# EAGLE schematic shield_ct_sensor (EAGLE 7.2.0)
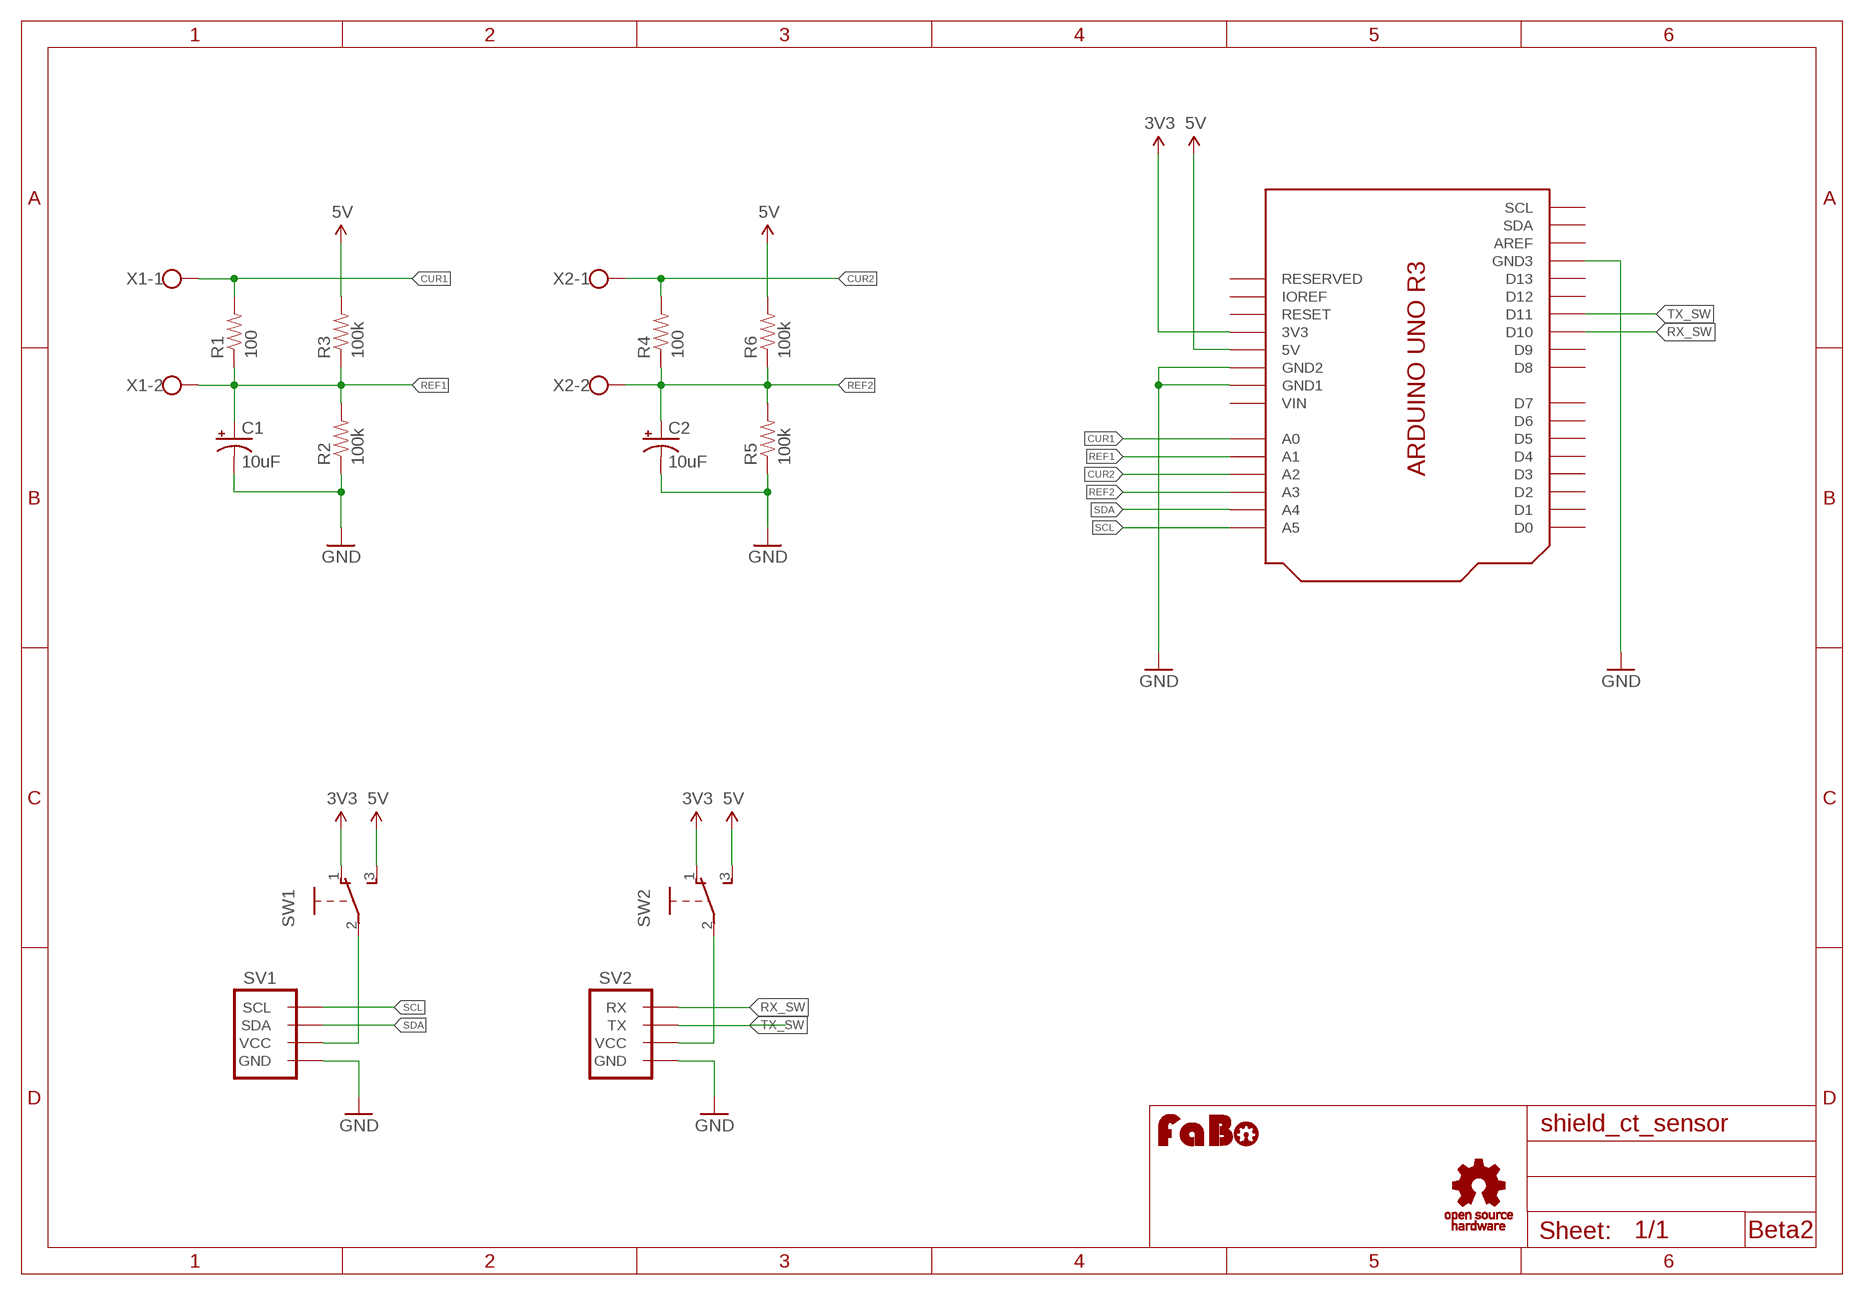
[diagram p0: schematic, sheet 1]

## Parts
C1  10uF  CAP_POL-AXL-5MM  [CAP-POL-AXL-5MM]
C2  10uF  CAP_POL-AXL-5MM  [CAP-POL-AXL-5MM]
R1  100  RES-PTH-REGULAR  [RES-AXL-REGULAR]
R2  100k  RES-PTH-REGULAR  [RES-AXL-REGULAR]
R3  100k  RES-PTH-REGULAR  [RES-AXL-REGULAR]
R4  100  RES-PTH-REGULAR  [RES-AXL-REGULAR]
R5  100k  RES-PTH-REGULAR  [RES-AXL-REGULAR]
R6  100k  RES-PTH-REGULAR  [RES-AXL-REGULAR]
SV1  BRICK_I2C_CONNECTOR  [BRICK_I2C_CONNECTOR]
SV2  BRICK_SERIAL_CONNECTOR  [BRICK_SERIAL_CONNECTOR]
SW1  SWITCH-SLIDE-EG1218  [EG1218]
SW2  SWITCH-SLIDE-EG1218  [EG1218]
U1  ARDUINO_UNO_R3_SHIELD  [ARDUINO_UNO_R3]
U$2  LOGO_FABO-M  [LOGO_FABO_M]
U$3  LOGO_OSHW_T-M  [LOGO_OSHW_T_M]
X1  W237-102  [W237-102]
X2  W237-102  [W237-102]

## Nets
3V3: SW1.1 SW2.1 U1.3V3
5V: R3.P$2 R6.P$2 SW1.3 SW2.3 U1.5V
CUR1: R1.P$2 U1.A0 X1.1
CUR2: R4.P$2 U1.A2 X2.1
GND: C1.- C2.- R2.P$1 R5.P$1 SV1.GND SV2.GND U1.GND1 U1.GND2 U1.GND3
N$1: SV2.VCC SW2.2
N$2: SV1.VCC SW1.2
REF1: C1.+ R1.P$1 R2.P$2 R3.P$1 U1.A1 X1.2
REF2: C2.+ R4.P$1 R5.P$2 R6.P$1 U1.A3 X2.2
RX_SW: SV2.RX U1.D10
SCL: SV1.SCL U1.A5
SDA: SV1.SDA U1.A4
TX_SW: SV2.TX U1.D11
Unconnected: U1.AREF U1.D0 U1.D1 U1.D2 U1.D3 U1.D4 U1.D5 U1.D6 U1.D7 U1.D8 U1.D9 U1.D12 U1.D13 U1.IOREF U1.RESERVED U1.RESET U1.SCL U1.SDA

## Notes on the sheet
- Beta2

## Power pins joined to a net without a drawn wire
VIN: U1.VIN

## Library data of the parts
C1 C2 = GClue:CAP_POL: Capacitor Polarized standard SMD and PTH capacitor
R1-R6 = GClue:RES
SV1 = GClue:BRICK_I2C_CONNECTOR: Brick Connector female for OUT/IN Shield
SV2 = GClue:BRICK_SERIAL_CONNECTOR
SW1 SW2 = GClue:SWITCH-SLIDE
U1 = GClue:ARDUINO_UNO_R3_SHIELD
U$2 = FaBo:LOGO_FABO
U$3 = GClue:LOGO_OSHW_T
X1 X2 = con-wago-500:W237-102: WAGO SCREW CLAMP; MPN: 237-102; OC_FARNELL: unknown; OC_NEWARK: 70K9898

## Net classes
0 default: width 0.254 mm